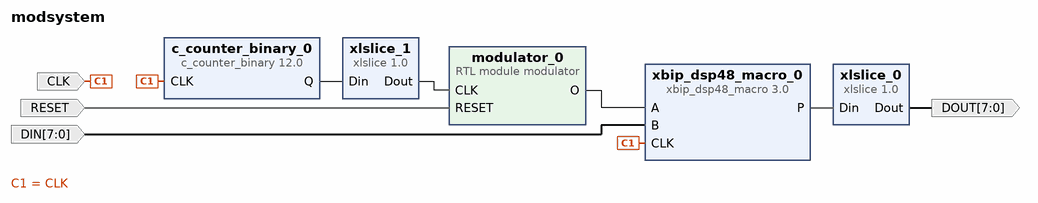
[diagram p0: block diagram of the top level]
# Vivado block design modsystem, xc7a12ticsg325-1L, Vivado 2020.2
create_bd_design modsystem

create_bd_port -dir I -type rst RESET
set_property -dict {CONFIG.POLARITY ACTIVE_HIGH} [get_bd_ports RESET]
create_bd_port -dir O -from 7 -to 0 DOUT
create_bd_port -dir I -type clk CLK
set_property -dict {CONFIG.FREQ_HZ 100000000} [get_bd_ports CLK]
create_bd_port -dir I -from 7 -to 0 -type data DIN

create_bd_cell -type ip -vlnv xilinx.com:ip:xbip_dsp48_macro:3.0 xbip_dsp48_macro_0
set_property -dict [list \
  CONFIG.a_width 8 \
  CONFIG.areg_3 true \
  CONFIG.areg_4 true \
  CONFIG.b_width 8 \
  CONFIG.breg_3 true \
  CONFIG.breg_4 true \
  CONFIG.creg_3 false \
  CONFIG.creg_4 false \
  CONFIG.creg_5 false \
  CONFIG.instruction1 {A*B} \
  CONFIG.mreg_5 true \
  CONFIG.p_binarywidth 0 \
  CONFIG.p_full_width 16 \
  CONFIG.p_width 16 \
  CONFIG.preg_6 true \
] [get_bd_cells xbip_dsp48_macro_0]
create_bd_cell -type ip -vlnv xilinx.com:ip:xlslice:1.0 xlslice_0
set_property -dict {CONFIG.DIN_FROM 15 CONFIG.DIN_TO 8 CONFIG.DIN_WIDTH 16 CONFIG.DOUT_WIDTH 8} [get_bd_cells xlslice_0]
create_bd_cell -type ip -vlnv xilinx.com:ip:c_counter_binary:12.0 c_counter_binary_0
set_property -dict {CONFIG.Output_Width 4} [get_bd_cells c_counter_binary_0]
create_bd_cell -type ip -vlnv xilinx.com:ip:xlslice:1.0 xlslice_1
set_property -dict {CONFIG.DIN_FROM 3 CONFIG.DIN_TO 3 CONFIG.DIN_WIDTH 4 CONFIG.DOUT_WIDTH 1} [get_bd_cells xlslice_1]
create_bd_cell -type module -reference modulator modulator_0

# ---- connections ----

connect_bd_net [get_bd_pins modulator_0/O] [get_bd_pins xbip_dsp48_macro_0/A]
connect_bd_net [get_bd_ports RESET] [get_bd_pins modulator_0/RESET]
connect_bd_net [get_bd_pins xbip_dsp48_macro_0/P] [get_bd_pins xlslice_0/Din]
connect_bd_net [get_bd_pins xlslice_0/Dout] [get_bd_ports DOUT]
connect_bd_net [get_bd_ports CLK] [get_bd_pins xbip_dsp48_macro_0/CLK] [get_bd_pins c_counter_binary_0/CLK]
connect_bd_net [get_bd_pins c_counter_binary_0/Q] [get_bd_pins xlslice_1/Din]
connect_bd_net [get_bd_pins xlslice_1/Dout] [get_bd_pins modulator_0/CLK]
connect_bd_net [get_bd_ports DIN] [get_bd_pins xbip_dsp48_macro_0/B]

validate_bd_design
save_bd_design
